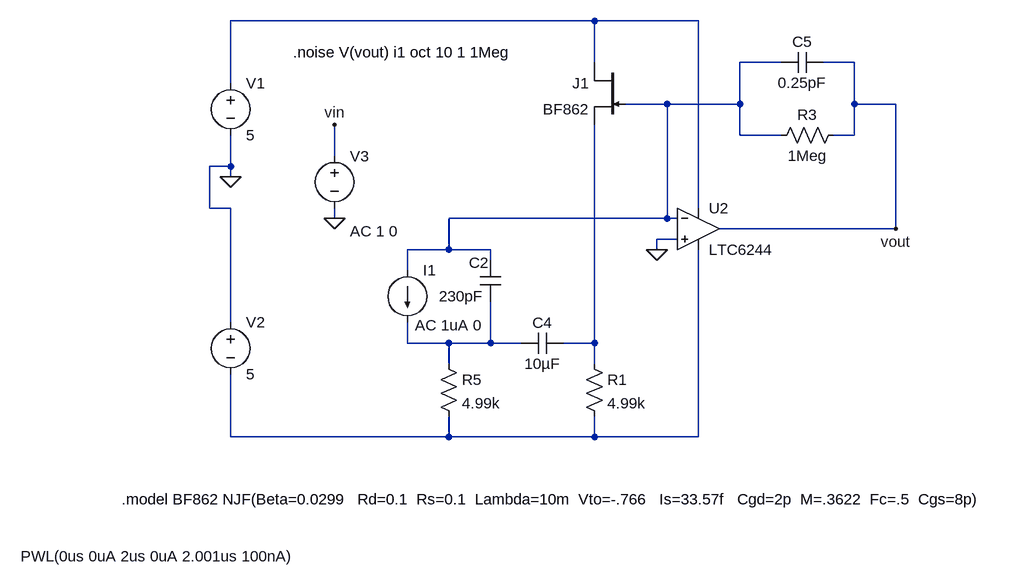
[diagram p0: schematic bootstrp6244b noise example.asc]
bootstrp6244b noise example.asc, the LTspice schematic file:
Version 4
SHEET 1 3232 872
WIRE 608 -256 48 -256
WIRE 768 -256 608 -256
WIRE 608 -192 608 -256
WIRE 896 -192 832 -192
WIRE 1008 -192 960 -192
WIRE 48 -160 48 -256
WIRE 720 -128 656 -128
WIRE 832 -128 832 -192
WIRE 832 -128 720 -128
WIRE 1008 -128 1008 -192
WIRE 1072 -128 1008 -128
WIRE 832 -80 832 -128
WIRE 896 -80 832 -80
WIRE 1008 -80 1008 -128
WIRE 1008 -80 976 -80
WIRE 208 -48 208 -96
WIRE 48 -32 48 -80
WIRE 48 -32 16 -32
WIRE 48 -16 48 -32
WIRE 16 32 16 -32
WIRE 48 32 16 32
WIRE 768 32 768 -256
WIRE 208 48 208 32
WIRE 720 48 720 -128
WIRE 720 48 384 48
WIRE 736 48 720 48
WIRE 1072 64 1072 -128
WIRE 1072 64 800 64
WIRE 736 80 704 80
WIRE 384 96 384 48
WIRE 384 96 320 96
WIRE 448 96 384 96
WIRE 704 96 704 80
WIRE 448 112 448 96
WIRE 320 128 320 96
WIRE 48 208 48 32
WIRE 320 240 320 208
WIRE 384 240 320 240
WIRE 448 240 448 176
WIRE 448 240 384 240
WIRE 496 240 448 240
WIRE 608 240 608 -96
WIRE 608 240 560 240
WIRE 384 272 384 240
WIRE 608 272 608 240
WIRE 48 384 48 288
WIRE 384 384 384 352
WIRE 384 384 48 384
WIRE 608 384 608 352
WIRE 608 384 384 384
WIRE 768 384 768 96
WIRE 768 384 608 384
FLAG 48 -16 0
FLAG 704 96 0
FLAG 1072 64 vout
FLAG 208 -96 vin
FLAG 208 48 0
SYMBOL voltage 48 -176 R0
SYMATTR InstName V1
SYMATTR Value 5
SYMBOL current 320 128 R0
WINDOW 3 -595 440 Left 0
WINDOW 123 12 84 Left 0
WINDOW 39 0 0 Left 0
SYMATTR Value PWL(0us 0uA 2us 0uA 2.001us 100nA)
SYMATTR Value2 AC 1uA 0
SYMATTR InstName I1
SYMBOL voltage 48 192 R0
SYMATTR InstName V2
SYMATTR Value 5
SYMBOL cap 432 112 R0
WINDOW 0 -17 4 Left 0
WINDOW 3 -63 56 Left 0
SYMATTR InstName C2
SYMATTR Value 230pF
SYMBOL res 992 -96 R90
WINDOW 0 0 56 VBottom 0
WINDOW 3 32 56 VTop 0
SYMATTR InstName R3
SYMATTR Value 1Meg
SYMBOL cap 960 -208 R90
WINDOW 0 0 32 VBottom 0
WINDOW 3 32 32 VTop 0
SYMATTR InstName C5
SYMATTR Value 0.25pF
SYMBOL njf 656 -192 M0
SYMATTR InstName J1
SYMATTR Value BF862
SYMBOL res 592 256 R0
SYMATTR InstName R1
SYMATTR Value 4.99k
SYMBOL cap 560 224 R90
WINDOW 0 0 32 VBottom 0
WINDOW 3 32 32 VTop 0
SYMATTR InstName C4
SYMATTR Value 10µF
SYMBOL res 368 256 R0
SYMATTR InstName R5
SYMATTR Value 4.99k
SYMBOL opamps\\LTC6244 768 64 R0
SYMATTR InstName U2
SYMBOL voltage 208 -64 R0
WINDOW 123 24 132 Left 0
WINDOW 39 0 0 Left 0
SYMATTR InstName V3
SYMATTR Value ""
SYMATTR Value2 AC 1 0
TEXT -120 480 Left 0 !.model BF862 NJF(Beta=0.0299   Rd=0.1  Rs=0.1  Lambda=10m  Vto=-.766   Is=33.57f   Cgd=2p  M=.3622  Fc=.5  Cgs=8p)
TEXT 144 -208 Left 0 !.noise V(vout) i1 oct 10 1 1Meg

The netlist it stands for:
* bootstrp6244b noise example.asc
V1 N001 0 5
I1 N002 N003 PWL(0us 0uA 2us 0uA 2.001us 100nA) AC 1uA 0
V2 0 N005 5
C2 N002 N003 230pF
R3 vout N002 1Meg
C5 vout N002 0.25pF
J1 N001 N002 N004 BF862
R1 N004 N005 4.99k
C4 N004 N003 10µF
R5 N003 N005 4.99k
XU2 0 N002 N001 N005 vout LTC6244  ; pins In+ In- V+ V- OUT
V3 vin 0 AC 1 0
.model NJF NJF
.model PJF PJF
.lib standard.jft
.model BF862 NJF(Beta=0.0299   Rd=0.1  Rs=0.1  Lambda=10m  Vto=-.766   Is=33.57f   Cgd=2p  M=.3622  Fc=.5  Cgs=8p)
.noise V(vout) i1 oct 10 1 1Meg
.backanno
.end